# Altium schematic sheet Power-5V.SchDoc
size A4
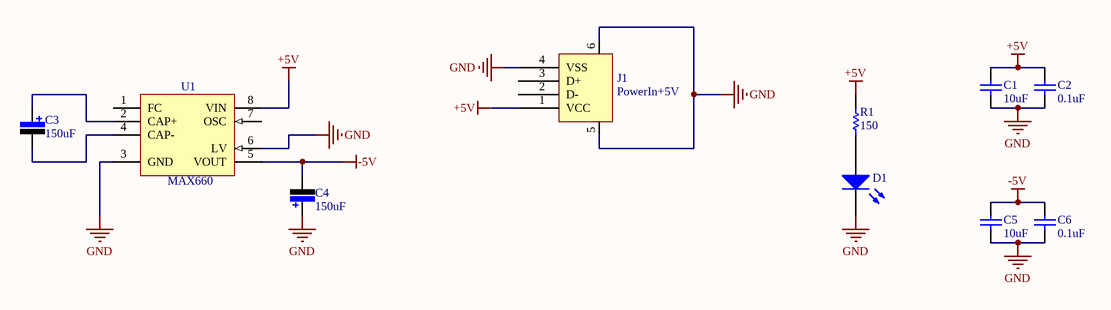
[diagram p0: Power-5V.SchDoc]

## Parts
C1  value 10uF  [RB0.1/0.2]  (hidden comment: Cap)
C2  value 0.1uF  [C-RAD]  (hidden comment: Cap)
C3  value 150uF  [RB0.15/3]  (hidden comment: Cap Pol)
C4  value 150uF  [RB0.15/3]  (hidden comment: Cap Pol)
C5  value 10uF  [RB0.1/0.2]  (hidden comment: Cap)
C6  value 0.1uF  [C-RAD]  (hidden comment: Cap)
D1  LED0  [RB2.54/4]  (value not drawn)
J1  PowerIn+5V  [USB_A1]
R1  value 150  [AXIAL-0.3]  (hidden comment: Res1)
U1  MAX660  [DIP-8]

## Nets
+5V: C1.2 C2.2 J1.1(VCC) R1.2 U1.8(VIN)
-5V: C4.2 C5.2 C6.2 U1.5(VOUT)
GND: C1.1 C2.1 C4.1 C5.1 C6.1 D1.2(K) J1.4(VSS) J1.5 J1.6 U1.3(GND) U1.6(LV)
NetC3_1: C3.1 U1.2(CAP+)
NetC3_2: C3.2 U1.4(CAP-)
NetD1_1: D1.1(A) R1.1

Not connected (* = marked no-connect by the designer): J1 2(D-) 3(D+); U1 1(FC) 7(OSC)

## Notes on the sheet
- 图纸大小
- 文件名：
- A4
- 版本号
- 创建日期
- 单位
- 2019/11/28
- HFUT
- 修改日期
- 作者
- XuPeng

## Library data of the parts
C1 C2 C5 C6 = Cap: 无极性电容; Published: 8-Jun-2000; PackageReference: RAD-0.3; Publisher: Altium Limited; LatestRevisionDate: 17-Jul-2002; LatestRevisionNote: Re-released for DXP Platform.
C3 C4 = Cap Pol: 极性电解电容; Vol: 16V; Published: 8-Jun-2000; LatestRevisionDate: 17-Jul-2002; LatestRevisionNote: Re-released for DXP Platform.; PackageReference: RB7.6-15; Publisher: Altium Limited
D1 = LED0: Typical INFRARED GaAs LED; Published: 8-Jun-2000; LatestRevisionDate: 08-Jul-2005; LatestRevisionNote: Mech Layer 1 removed.; PackageReference: LED-0; Publisher: Altium Limited; PackageDescription: LED; 2 Leads
J1 = USB: USB接口
R1 = Res1: Resistor; Published: 8-Jun-2000; LatestRevisionDate: 17-Jul-2002; LatestRevisionNote: Re-released for DXP Platform.; PackageReference: AXIAL-0.3; Publisher: Altium Limited; PackageDescription: Axial Device, Thru-Hole; 2 Leads; 0.3 in Pin Spacing
U1 = MAX660CSA: -5V电源芯片; Published: 16-Jan-2001; LatestRevisionDate: 13-Apr-2006; LatestRevisionNote: IPC-7351 Footprint Added.; DatasheetVersion: Sep-1996; PackageReference: NSO8; Publisher: Altium Limited; PackageDescription: 8-Pin Small Outline Integrated Circuit 1.27 mm Pitch; Code_JEDEC: MS-012-AA; Code_IPC: SOIC127P600-8; ComponentLink1Description: Manufacturer Link; ComponentLink1URL: http://www.maxim-ic.com/; ComponentLink2Description: Datasheet; ComponentLink2URL: http://pdfserv.maxim-ic.com/en/ds/MAX660.pdf